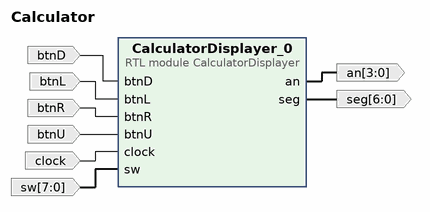
[diagram p0: block diagram of the top level]
# Vivado block design Calculator, xc7a35tcpg236-1, Vivado 2023.1
create_bd_design Calculator

create_bd_port -dir I -from 7 -to 0 sw
create_bd_port -dir I btnU
create_bd_port -dir I btnL
create_bd_port -dir I btnD
create_bd_port -dir I btnR
create_bd_port -dir I -type clk clock
create_bd_port -dir O -from 6 -to 0 seg
create_bd_port -dir O -from 3 -to 0 an

create_bd_cell -type module -reference CalculatorDisplayer CalculatorDisplayer_0

# ---- connections ----

connect_bd_net [get_bd_pins CalculatorDisplayer_0/an] [get_bd_ports an]
connect_bd_net [get_bd_pins CalculatorDisplayer_0/seg] [get_bd_ports seg]
connect_bd_net -net btnD_0_1 [get_bd_ports btnD] [get_bd_pins CalculatorDisplayer_0/btnD]
connect_bd_net -net btnL_0_1 [get_bd_ports btnL] [get_bd_pins CalculatorDisplayer_0/btnL]
connect_bd_net -net btnR_0_1 [get_bd_ports btnR] [get_bd_pins CalculatorDisplayer_0/btnR]
connect_bd_net -net btnU_0_1 [get_bd_ports btnU] [get_bd_pins CalculatorDisplayer_0/btnU]
connect_bd_net -net clock_0_1 [get_bd_ports clock] [get_bd_pins CalculatorDisplayer_0/clock]
connect_bd_net -net sw_0_1 [get_bd_ports sw] [get_bd_pins CalculatorDisplayer_0/sw]

validate_bd_design
save_bd_design
